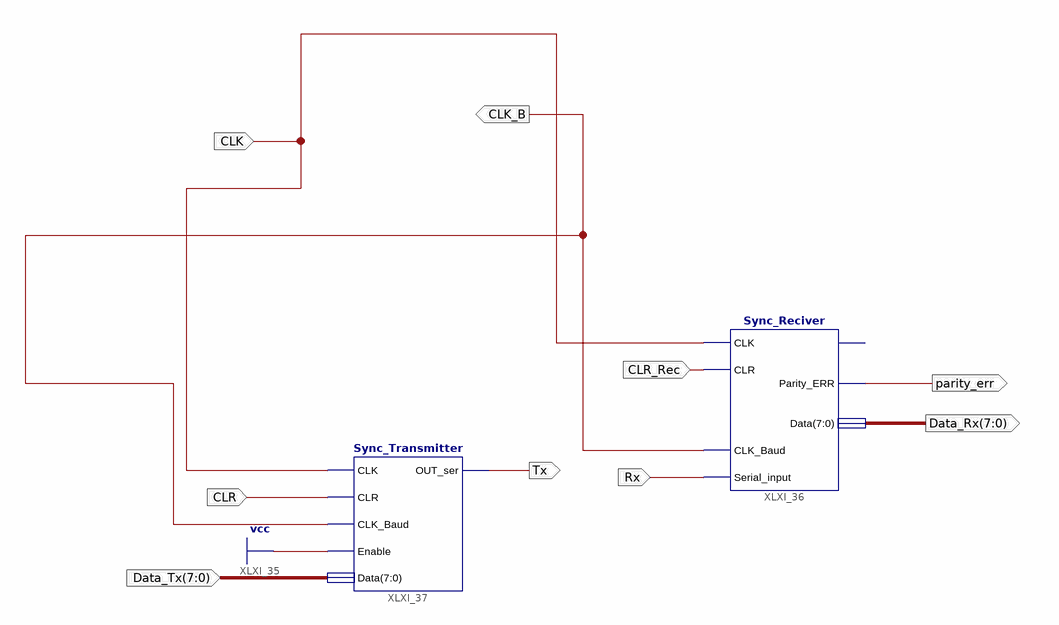
[diagram p0: schematic sheet 1]
// Xilinx ISE schematic test_usart.sch (spartan3e) as structural Verilog: 2 symbols, 9 ports
module test_usart (
  input  CLK,
  input  CLR,
  input  Rx,
  input  [7:0] Data_Tx,
  input  CLR_Rec,
  output Tx,
  output CLK_B,
  output parity_err,
  output [7:0] Data_Rx
);

  Sync_Reciver XLXI_36 (
    .CLK(CLK), .CLR(CLR_Rec), .Parity_ERR(parity_err), .Data(Data_Rx), .CLK_Baud(CLK_B), .Serial_input(Rx));  // open: Data_Ready
  Sync_Transmitter XLXI_37 (.CLK(CLK), .CLR(CLR), .Enable(1'b1), .Data(Data_Tx), .CLK_Baud(CLK_B), .OUT_ser(Tx));
endmodule
